# EAGLE schematic 6809 EXPANDED V2 SBC (EAGLE 7.7.0)

## Sheet 1 of 2
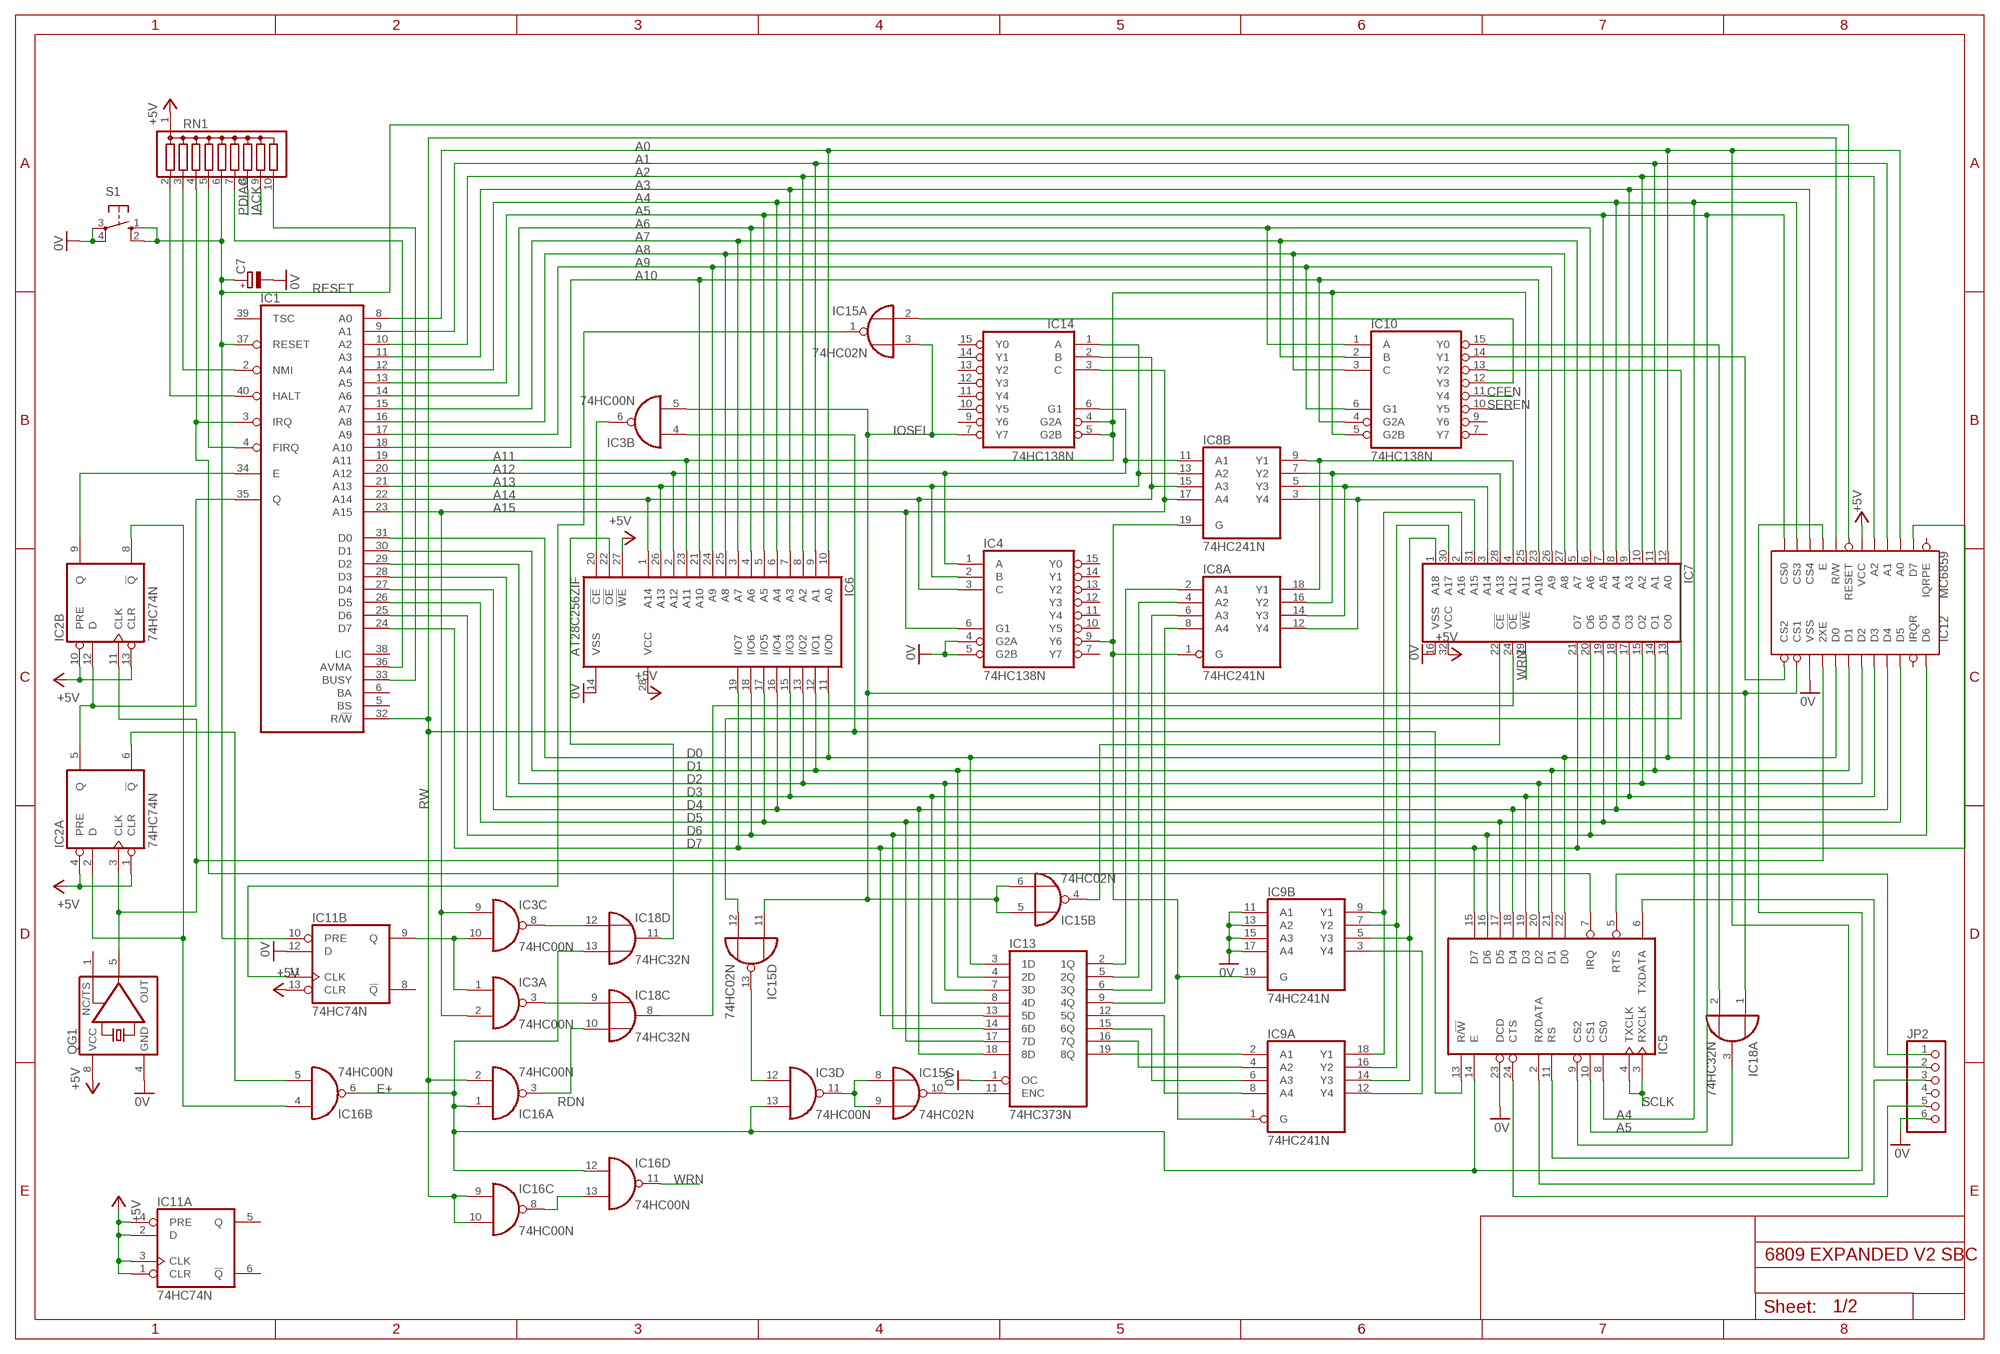
[diagram p0: schematic, sheet 1]

### Parts
C7  CPOL-EUE2-5  [E2-5]
IC1  6809E  [DIL40]
IC2  74HC74N  [DIL14]
IC3  74HC00N  [DIL14]
IC4  74HC138N  [DIL16]
IC5  6850  [DIL24]
IC6  AT28C256ZIF  [228-1277-00-0602J]
IC7  AS6C4008  [DIL32]
IC8  74HC241N  [DIL20]
IC9  74HC241N  [DIL20]
IC10  74HC138N  [DIL16]
IC11  74HC74N  [DIL14]
IC12  MC6859  [DIL24-6]
IC13  74HC373N  [DIL20]
IC14  74HC138N  [DIL16]
IC15  74HC02N  [DIL14]
IC16  74HC00N  [DIL14]
IC18  74HC32N  [DIL14]
JP2  PINHD-1X6/90  [1X06/90]
QG1  XO-8  [DIL08S]
RN1  G09R  [SIL10]
S1  10-XX  [B3F-10XX]

### Nets
0V: C7.- IC4.4(G2A) IC4.5(G2B) IC5.23(DCD) IC6.14(VSS) IC7.16(VSS) IC9.11(B:A1) IC9.13(B:A2) IC9.15(B:A3) IC9.17(B:A4) IC11.12(B:D) IC12.15(VSS) IC13.1(OC) JP2.6 QG1.4(GND) S1.3(P) S1.4(P1) ; also sheet 2
+5V: IC2.1(A:CLR) IC2.4(A:PRE) IC2.10(B:PRE) IC2.13(B:CLR) IC6.27(!WE) IC6.28(VCC) IC7.32(VCC) IC11.1(A:CLR) IC11.2(A:D) IC11.3(A:CLK) IC11.4(A:PRE) IC11.13(B:CLR) IC12.6(VCC) QG1.8(VCC) RN1.1 ; also sheet 2
A0: IC1.8(A0) IC5.11(RS) IC6.10(A0) IC7.12(A0) IC12.3(A0) ; also sheet 2
A1: IC1.9(A1) IC6.9(A1) IC7.11(A1) IC12.4(A1) ; also sheet 2
A2: IC1.10(A2) IC6.8(A2) IC7.10(A2) IC12.5(A2) ; also sheet 2
A3: IC1.11(A3) IC6.7(A3) IC7.9(A3) IC12.10(CS4) ; also sheet 2
A4: IC1.12(A4) IC5.8(CS0) IC6.6(A4) IC7.8(A4) IC12.11(CS3) ; also sheet 2
A5: IC1.13(A5) IC5.10(CS1) IC6.5(A5) IC7.7(A5) IC12.12(CS0) ; also sheet 2
A6: IC1.14(A6) IC6.4(A6) IC7.6(A6) IC10.1(A)
A7: IC1.15(A7) IC6.3(A7) IC7.5(A7) IC10.2(B)
A8: IC1.16(A8) IC6.25(A8) IC7.27(A8) IC10.3(C)
A9: IC1.17(A9) IC6.24(A9) IC7.26(A9) IC10.6(G1)
A10: IC1.18(A10) IC6.21(A10) IC7.23(A10) IC10.4(G2A)
A11: IC1.19(A11) IC6.23(A11) IC7.25(A11) IC10.5(G2B) IC14.4(G2A) IC14.5(G2B)
A12: IC1.20(A12) IC4.1(A) IC6.2(A12) IC8.11(B:A1) IC14.6(G1)
A13: IC1.21(A13) IC4.2(B) IC6.26(A13) IC8.13(B:A2) IC14.1(A)
A14: IC1.22(A14) IC4.3(C) IC6.1(A14) IC8.15(B:A3) IC14.2(B)
A15: IC1.23(A15) IC3.2(A:I1) IC3.9(C:I0) IC4.6(G1) IC8.17(B:A4) IC14.3(C)
CFEN: IC10.11(Y4) ; also sheet 2
D0: IC1.31(D0) IC5.22(D0) IC6.11(I/O0) IC7.13(O0) IC12.17(D0) IC13.3(1D) ; also sheet 2
D1: IC1.30(D1) IC5.21(D1) IC6.12(I/O1) IC7.14(O1) IC12.18(D1) IC13.4(2D) ; also sheet 2
D2: IC1.29(D2) IC5.20(D2) IC6.13(I/O2) IC7.15(O2) IC12.19(D2) IC13.7(3D) ; also sheet 2
D3: IC1.28(D3) IC5.19(D3) IC6.15(I/O3) IC7.17(O3) IC12.20(D3) IC13.8(4D) ; also sheet 2
D4: IC1.27(D4) IC5.18(D4) IC6.16(I/O4) IC7.18(O4) IC12.21(D4) IC13.18(8D) ; also sheet 2
D5: IC1.26(D5) IC5.17(D5) IC6.17(I/O5) IC7.19(O5) IC12.22(D5) IC13.17(7D) ; also sheet 2
D6: IC1.25(D6) IC5.16(D6) IC6.18(I/O6) IC7.20(O6) IC12.24(D6) IC13.14(6D) ; also sheet 2
D7: IC1.24(D7) IC5.15(D7) IC6.19(I/O7) IC7.21(O7) IC12.2(D7) IC13.13(5D) ; also sheet 2
E+: IC3.13(D:I1) IC5.14(E) IC12.9(E) IC16.1(A:I0) IC16.6(B:O) IC16.12(D:I0) IC18.13(D:I1)
IACK: RN1.9 ; also sheet 2
IOSEL: IC3.5(B:I1) IC12.14(CS1) IC14.7(Y7) IC15.3(A:I1) IC15.5(B:I0) IC15.6(B:I1) IC15.11(D:I0) IC18.1(A:I0) ; also sheet 2
N$1: IC2.6(A:!Q) IC16.5(B:I1)
N$2: IC2.2(A:D) IC2.8(B:!Q) IC16.4(B:I0)
N$3: IC2.3(A:CLK) IC2.11(B:CLK) IC12.16(2XE) QG1.5(OUT)
N$4: IC1.4(FIRQ) RN1.5
N$5: IC1.35(Q) IC2.5(A:Q) IC2.12(B:D)
N$6: IC3.12(D:I0) IC15.13(D:O)
N$7: IC10.13(Y2) IC15.12(D:I1)
N$8: IC3.11(D:O) IC15.8(C:I0) IC15.9(C:I1)
N$9: IC1.34(E) IC2.9(B:Q)
N$11: IC3.1(A:I0) IC3.10(C:I1) IC11.9(B:Q)
N$12: IC7.22(!CE) IC15.4(B:O)
N$13: IC10.12(Y3) IC15.2(A:I0)
N$14: IC3.3(A:O) IC18.9(C:I0)
N$15: IC11.11(B:CLK) IC15.1(A:O)
N$16: IC7.24(!OE) IC18.8(C:O)
N$17: IC6.22(!OE) IC18.11(D:O)
N$18: IC9.2(A:A1) IC13.19(8Q)
N$19: IC13.11(ENC) IC15.10(C:O)
N$21: IC16.8(C:O) IC16.13(D:I1)
N$23: IC3.8(C:O) IC18.12(D:I0)
N$24: IC10.14(Y1) IC12.13(CS2)
N$25: IC5.5(RTS) JP2.1
N$30: IC1.40(HALT) RN1.2
N$33: IC3.6(B:O) IC6.20(!CE)
N$36: IC1.36(AVMA) RN1.7
N$37: IC1.33(BUSY) RN1.10
N$38: IC1.3(IRQ) IC5.7(IRQ) RN1.4
N$40: IC5.24(CTS) JP2.5
N$42: IC1.2(NMI) RN1.3
N$45: IC5.6(TXDATA) JP2.2
N$46: IC5.2(RXDATA) JP2.3
N$47: IC4.9(Y6) IC8.1(A:G) IC8.19(B:G) IC9.1(A:G) IC9.19(B:G)
N$48: IC7.4(A12) IC8.9(B:Y1) IC8.18(A:Y1)
N$49: IC7.28(A13) IC8.7(B:Y2) IC8.16(A:Y2)
N$50: IC7.3(A14) IC8.5(B:Y3) IC8.14(A:Y3)
N$51: IC7.31(A15) IC8.3(B:Y4) IC8.12(A:Y4)
N$52: IC9.8(A:A4) IC13.12(5Q)
N$53: IC10.15(Y0) IC18.2(A:I1)
N$54: IC9.4(A:A2) IC13.16(7Q)
N$55: IC9.6(A:A3) IC13.15(6Q)
N$56: IC7.2(A16) IC9.9(B:Y1) IC9.18(A:Y1)
N$57: IC7.30(A17) IC9.7(B:Y2) IC9.16(A:Y2)
N$58: IC7.1(A18) IC9.5(B:Y3) IC9.14(A:Y3)
N$59: IC9.3(B:Y4) IC9.12(A:Y4)
N$61: IC8.8(A:A4) IC13.9(4Q)
N$62: IC8.6(A:A3) IC13.6(3Q)
N$63: IC8.4(A:A2) IC13.5(2Q)
N$64: IC8.2(A:A1) IC13.2(1Q)
N$71: IC5.9(CS2) IC18.3(A:O)
PDIAG: RN1.8 ; also sheet 2
RDN: IC16.3(A:O) IC18.10(C:I1) ; also sheet 2
RESET: C7.+ IC1.37(RESET) IC11.10(B:PRE) IC12.7(RESET) RN1.6 S1.1(S) S1.2(S1) ; also sheet 2
RW: IC1.32(R/!W) IC3.4(B:I0) IC5.13(R/!W) IC12.8(R/W) IC16.2(A:I1) IC16.9(C:I0) IC16.10(C:I1) ; also sheet 2
SCLK: IC5.3(RXCLK) IC5.4(TXCLK) ; also sheet 2
SEREN: IC10.10(Y5) ; also sheet 2
WRN: IC7.29(!WE) IC16.11(D:O) ; also sheet 2
Unconnected: IC1.5(BS) IC1.6(BA) IC1.38(LIC) IC1.39(TSC) IC4.7(Y7) IC4.10(Y5) IC4.11(Y4) IC4.12(Y3) IC4.13(Y2) IC4.14(Y1) IC4.15(Y0) IC10.7(Y7) IC10.9(Y6) IC11.5(A:Q) IC11.6(A:!Q) IC11.8(B:!Q) IC12.1(IQRPE) IC12.23(IRQR) IC14.9(Y6) IC14.10(Y5) IC14.11(Y4) IC14.12(Y3) IC14.13(Y2) IC14.14(Y1) IC14.15(Y0) JP2.4 QG1.1(TS)

## Sheet 2 of 2
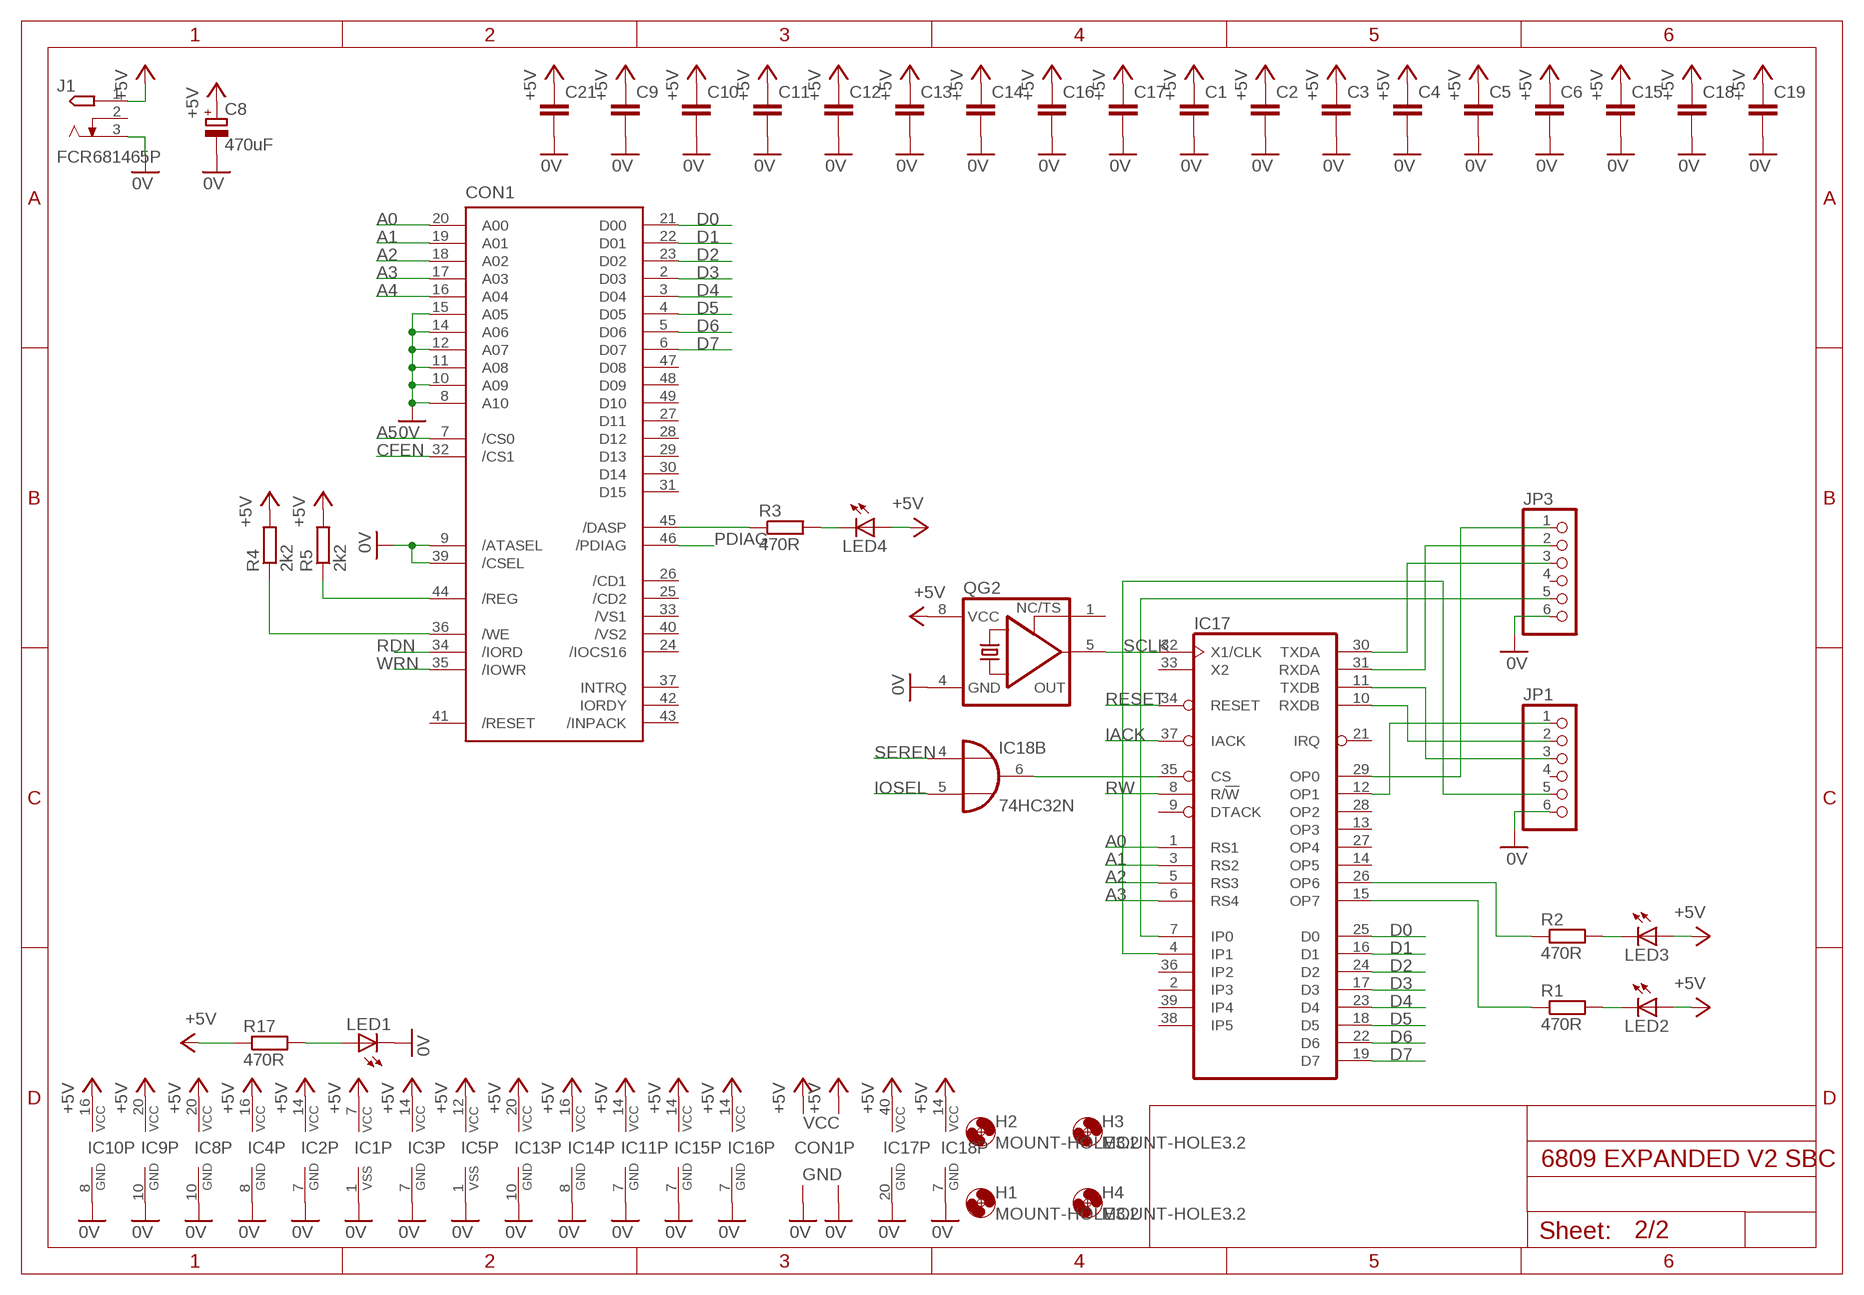
[diagram p1: schematic, sheet 2]

### Parts
C1  C-EU025-025X050  [C025-025X050]
C2  C-EU025-025X050  [C025-025X050]
C3  C-EU025-025X050  [C025-025X050]
C4  C-EU025-025X050  [C025-025X050]
C5  C-EU025-025X050  [C025-025X050]
C6  C-EU025-025X050  [C025-025X050]
C8  470uF  CPOL-EUE5-10.5  [E5-10,5]
C9  C-EU025-025X050  [C025-025X050]
C10  C-EU025-025X050  [C025-025X050]
C11  C-EU025-025X050  [C025-025X050]
C12  C-EU025-025X050  [C025-025X050]
C13  C-EU025-025X050  [C025-025X050]
C14  C-EU025-025X050  [C025-025X050]
C15  C-EU025-025X050  [C025-025X050]
C16  C-EU025-025X050  [C025-025X050]
C17  C-EU025-025X050  [C025-025X050]
C18  C-EU025-025X050  [C025-025X050]
C19  C-EU025-025X050  [C025-025X050]
C21  C-EU025-025X050  [C025-025X050]
CON1  CF-CARD-IDE_MODE  [MI20-50PD-SF]
H1  MOUNT-HOLE3.2  [3,2]
H2  MOUNT-HOLE3.2  [3,2]
H3  MOUNT-HOLE3.2  [3,2]
H4  MOUNT-HOLE3.2  [3,2]
IC17  MC68681P  [DIL40]
J1  FCR681465P  [FCR681465P]
JP1  PINHD-1X6/90  [1X06/90]
JP3  PINHD-1X6/90  [1X06/90]
LED1  LED3MM  [LED3MM]
LED2  LED3MM  [LED3MM]
LED3  LED3MM  [LED3MM]
LED4  LED3MM  [LED3MM]
QG2  XO-8  [DIL08S]
R1  470R  R-EU_0207/10  [0207/10]
R2  470R  R-EU_0207/10  [0207/10]
R3  470R  R-EU_0207/10  [0207/10]
R4  2k2  R-EU_0207/10  [0207/10]
R5  2k2  R-EU_0207/10  [0207/10]
R17  470R  R-EU_0207/10  [0207/10]

### Nets
0V: C1.2 C2.2 C3.2 C4.2 C5.2 C6.2 C8.- C9.2 C10.2 C11.2 C12.2 C13.2 C14.2 C15.2 C16.2 C17.2 C18.2 C19.2 C21.2 CON1.1(GND1) CON1.8(A10) CON1.9(/ATASEL) CON1.10(A09) CON1.11(A08) CON1.12(A07) CON1.14(A06) CON1.15(A05) CON1.39(/CSEL) CON1.50(GND2) IC1.1(VSS) IC2.7(P:GND) IC3.7(P:GND) IC4.8(GND) IC5.1(VSS) IC8.10(P:GND) IC9.10(P:GND) IC10.8(GND) IC11.7(P:GND) IC13.10(GND) IC14.8(GND) IC15.7(P:GND) IC16.7(P:GND) IC17.20(GND) IC18.7(P:GND) J1.3 JP1.6 JP3.6 LED1.K(C) QG2.4(GND) ; also sheet 1
+5V: C1.1 C2.1 C3.1 C4.1 C5.1 C6.1 C8.+ C9.1 C10.1 C11.1 C12.1 C13.1 C14.1 C15.1 C16.1 C17.1 C18.1 C19.1 C21.1 CON1.13(VCC2) CON1.38(VCC1) IC1.7(VCC) IC2.14(P:VCC) IC3.14(P:VCC) IC4.16(VCC) IC5.12(VCC) IC8.20(P:VCC) IC9.20(P:VCC) IC10.16(VCC) IC11.14(P:VCC) IC13.20(VCC) IC14.16(VCC) IC15.14(P:VCC) IC16.14(P:VCC) IC17.40(VCC) IC18.14(P:VCC) J1.1 LED2.A LED3.A LED4.A QG2.8(VCC) R4.2 R5.2 R17.1 ; also sheet 1
A0: CON1.20(A00) IC17.1(RS1) ; also sheet 1
A1: CON1.19(A01) IC17.3(RS2) ; also sheet 1
A2: CON1.18(A02) IC17.5(RS3) ; also sheet 1
A3: CON1.17(A03) IC17.6(RS4) ; also sheet 1
A4: CON1.16(A04) ; also sheet 1
A5: CON1.7(/CS0) ; also sheet 1
CFEN: CON1.32(/CS1) ; also sheet 1
D0: CON1.21(D00) IC17.25(D0) ; also sheet 1
D1: CON1.22(D01) IC17.16(D1) ; also sheet 1
D2: CON1.23(D02) IC17.24(D2) ; also sheet 1
D3: CON1.2(D03) IC17.17(D3) ; also sheet 1
D4: CON1.3(D04) IC17.23(D4) ; also sheet 1
D5: CON1.4(D05) IC17.18(D5) ; also sheet 1
D6: CON1.5(D06) IC17.22(D6) ; also sheet 1
D7: CON1.6(D07) IC17.19(D7) ; also sheet 1
IACK: IC17.37(IACK) ; also sheet 1
IOSEL: IC18.5(B:I1) ; also sheet 1
N$10: IC17.35(CS) IC18.6(B:O)
N$26: LED1.A R17.2
N$28: IC17.31(RXDA) JP3.2
N$29: IC17.30(TXDA) JP3.3
N$31: IC17.11(TXDB) JP1.3
N$32: IC17.10(RXDB) JP1.2
N$34: IC17.7(IP0) JP3.5
N$35: IC17.4(IP1) JP1.5
N$39: IC17.29(OP0) JP3.1
N$41: LED3.K(C) R2.2
N$43: IC17.12(OP1) JP1.1
N$44: LED2.K(C) R1.2
N$60: IC17.26(OP6) R2.1
N$65: IC17.15(OP7) R1.1
N$66: CON1.45(/DASP) R3.1
N$67: LED4.K(C) R3.2
N$68: CON1.44(/REG) R5.1
N$69: CON1.36(/WE) R4.1
PDIAG: CON1.46(/PDIAG) ; also sheet 1
RDN: CON1.34(/IORD) ; also sheet 1
RESET: IC17.34(RESET) ; also sheet 1
RW: IC17.8(R/!W) ; also sheet 1
SCLK: IC17.32(X1/CLK) QG2.5(OUT) ; also sheet 1
SEREN: IC18.4(B:I0) ; also sheet 1
WRN: CON1.35(/IOWR) ; also sheet 1
Unconnected: CON1.24(/IOCS16) CON1.25(/CD2) CON1.26(/CD1) CON1.27(D11) CON1.28(D12) CON1.29(D13) CON1.30(D14) CON1.31(D15) CON1.33(/VS1) CON1.37(INTRQ) CON1.40(/VS2) CON1.41(/RESET) CON1.42(IORDY) CON1.43(/INPACK) CON1.47(D08) CON1.48(D09) CON1.49(D10) IC17.2(IP3) IC17.9(DTACK) IC17.13(OP3) IC17.14(OP5) IC17.21(IRQ) IC17.27(OP4) IC17.28(OP2) IC17.33(X2) IC17.36(IP2) IC17.38(IP5) IC17.39(IP4) J1.2 JP1.4 JP3.4 QG2.1(TS)

## Library data of the parts
C1-C6 C9-C19 C21 = rcl:C-EU: CAPACITOR, European symbol
C7 C8 = rcl:CPOL-EU: POLARIZED CAPACITOR, European symbol
CON1 = LTA_connectors:CF-CARD-IDE_MODE: Compact Flash Adapter Type I or II without Eject Button Source: con-hirose.lbr from Bob Starr <rtzaudio@mindspring.com>; OC_FARNELL: unknown; OC_NEWARK: unknown
H1-H4 = holes:MOUNT-HOLE: MOUNTING HOLE with drill center marker
IC1 = micro-motorola:6809E: MICROCONTROLLER/MEMORY DEVICE; MF: NTE ELECTRONICS; MPN: NTE6809E; OC_FARNELL: unknown; OC_NEWARK: 31C5318
IC2 IC11 = 74xx-eu:74*74: Dual D type positive edge triggered FLIP FLOP, preset and clear
IC3 IC16 = 74xx-eu:74*00: Quad 2-input NAND gate
IC4 IC10 IC14 = 74xx-eu:74*138: 3-line to 8-line DECODER/DEMULTIPLEXER
IC5 = micro-motorola:6850: MICROCONTROLLER/MEMORY DEVICE; MF: NTE ELECTRONICS; MPN: NTE6850; OC_FARNELL: 4899775; OC_NEWARK: 31C2457
IC6 = LTA_semis:AT28C256
IC7 = LTA_semis:AS6C4008: MEMORY
IC8 IC9 = 74xx-eu:74*241: Octal BUFFER and LINE DRIVER, 3-state
IC12 = LTA_semis:MC6859
IC13 = 74xx-eu:74*373: Octal D type transparent LATCH, edge triggered
IC15 = 74xx-eu:74*02: Quad 2-input NOR gate
IC17 = micro-mc68000:MC68681P: 68xxx PROCESSOR; OC_FARNELL: unknown; OC_NEWARK: unknown
IC18 = 74xx-eu:74*32: Quad 2-input OR gate
J1 = PowerCon:FCR681465P
JP1-JP3 = pinhead:PINHD-1X6: PIN HEADER
LED1-LED4 = led:LED: LED OSRAM: - CHIPLED LG R971, LG N971, LY N971, LG Q971, LY Q971, LO R971, LY R971 LH N974, LH R974 LS Q976, LO Q976, LY Q976 LO Q996 - Hyper CHIPLED LW Q18S LB Q993, LB Q99A, LB R99A - SideLED LS A670, LO A670, LY A670, LG A670, LP A670 LB A673, LV A673, LT A673, LW A673 LH A674 LY A675 LS A676, LA A676, LO A676, LY A676, LW A676 LS A679, LY A679, LG A679 - Hyper Micro SIDELED® LS Y876, LA Y876, LO Y876, LY Y876 LT Y87S - SmartLED LW L88C, LW L88S LB L89C, LB L89S, LG L890 LS L89K, LO L89K, LY L89K LS L896, LA L896, LO L896, LY L896 - TOPLED LS T670, LO T670, LY T670, LG T670, LP T670 LSG T670, LSP T670, LSY T670, LOP T670, LYG T670 LG T671, LOG T671, LSG T671 LB T673, LV T673, LT T673, LW T673 LH T674 LS T676, LA T676, LO T676, LY T676, LB T676, LH T676, LSB T676, LW T676 LB T67C, LV T67C, LT T67C, LS T67K, LO T67K, LY T67K, LW E67C LS E67B, LA E67B, LO E67B, LY E67B, LB E67C, LV E67C, LT E67C LW T67C LS T679, LY T679, LG T679 LS T770, LO T770, LY T770, LG T770, LP T770 LB T773, LV T773, LT T773, LW T773 LH T774 LS E675, LA E675, LY E675, LS T675 LS T776, LA T776, LO T776, LY T776, LB T776 LHGB T686 LT T68C, LB T68C - Hyper Mini TOPLED® LB M676 - Mini TOPLED Santana® LG M470 LS M47K, LO M47K, LY M47K Source: http://www.osram.convergy.de LUXEON: - LUMILED® LXK2-PW12-R00, LXK2-PW12-S00, LXK2-PW14-U00, LXK2-PW14-V00 LXK2-PM12-R00, LXK2-PM12-S00, LXK2-PM14-U00 LXK2-PE12-Q00, LXK2-PE12-R00, LXK2-PE12-S00, LXK2-PE14-T00, LXK2-PE14-U00 LXK2-PB12-K00, LXK2-PB12-L00, LXK2-PB12-M00, LXK2-PB14-N00, LXK2-PB14-P00, LXK2-PB14-Q00 LXK2-PR12-L00, LXK2-PR12-M00, LXK2-PR14-Q00, LXK2-PR14-R00 LXK2-PD12-Q00, LXK2-PD12-R00, LXK2-PD12-S00 LXK2-PH12-R00, LXK2-PH12-S00 LXK2-PL12-P00, LXK2-PL12-Q00, LXK2-PL12-R00 Source: www.luxeon.com KINGBRIGHT: KA-3528ASYC Source: www.kingbright.com
QG1 QG2 = crystal:XO-: CRYSTAL; OC_FARNELL: unknown; OC_NEWARK: unknown
R1-R5 R17 = rcl:R-EU_: RESISTOR, European symbol
RN1 = resistor-sil:G09R: SIL RESISTOR; OC_FARNELL: unknown; OC_NEWARK: unknown
S1 = switch-omron:10-XX: OMRON SWITCH; MPN: B3F-1000; OC_FARNELL: 176432; OC_NEWARK: 36M3542